# EAGLE design MAX232 (EAGLE 5.11)
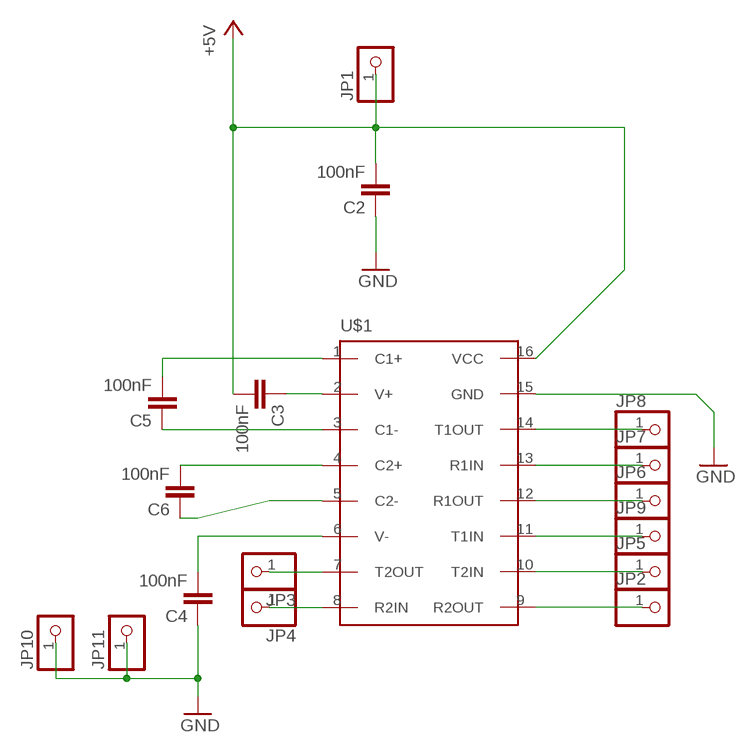
[diagram p0: schematic, sheet 1]

## Parts
C2  100nF  C-EUC1206  [C1206]
C3  100nF  C-EUC1206  [C1206]
C4  100nF  C-EUC1206  [C1206]
C5  100nF  C-EUC1206  [C1206]
C6  100nF  C-EUC1206  [C1206]
JP1  PINHD-1X1  [1X01]
JP2  PINHD-1X1  [1X01]
JP3  PINHD-1X1  [1X01]
JP4  PINHD-1X1  [1X01]
JP5  PINHD-1X1  [1X01]
JP6  PINHD-1X1  [1X01]
JP7  PINHD-1X1  [1X01]
JP8  PINHD-1X1  [1X01]
JP9  PINHD-1X1  [1X01]
JP10  PINHD-1X1  [1X01]
JP11  PINHD-1X1  [1X01]
U$1  MAX232ACUE  [TSSOP16]

## Nets
+5V: C2.2 C3.2 JP1.1 U$1.16(VCC)
GND: C2.1 C4.1 JP10.1 JP11.1 U$1.15(GND)
N$1: C5.2 U$1.1(C1+)
N$2: C5.1 U$1.3(C1-)
N$3: C6.1 U$1.5(C2-)
N$4: C6.2 U$1.4(C2+)
N$5: C4.2 U$1.6(V-)
N$6: C3.1 U$1.2(V+)
N$7: JP8.1 U$1.14(T1OUT)
N$8: JP7.1 U$1.13(R1IN)
N$9: JP6.1 U$1.12(R1OUT)
N$10: JP9.1 U$1.11(T1IN)
N$11: JP5.1 U$1.10(T2IN)
N$12: JP2.1 U$1.9(R2OUT)
N$13: JP4.1 U$1.8(R2IN)
N$14: JP3.1 U$1.7(T2OUT)

## Library data of the parts
C2-C6 = rcl:C-EU: CAPACITOR, European symbol
JP1-JP11 = pinhead:PINHD-1X1: PIN HEADER
U$1 = sams:MAX232ACUE

## Board
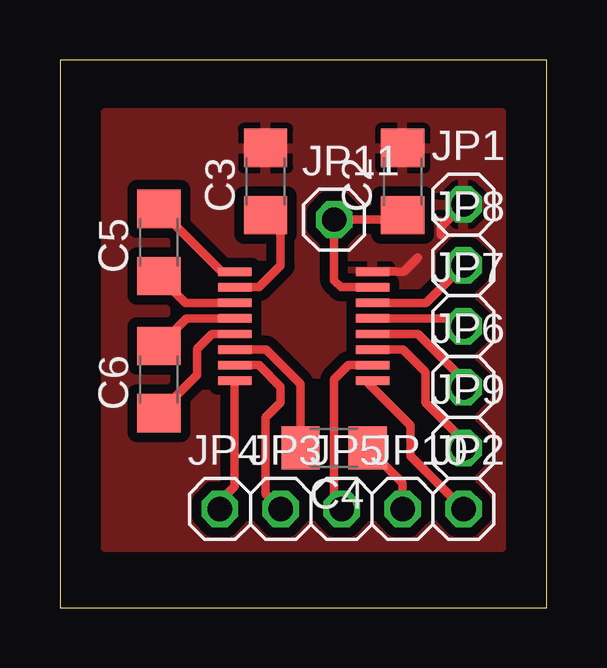
[diagram p1: board, top side]
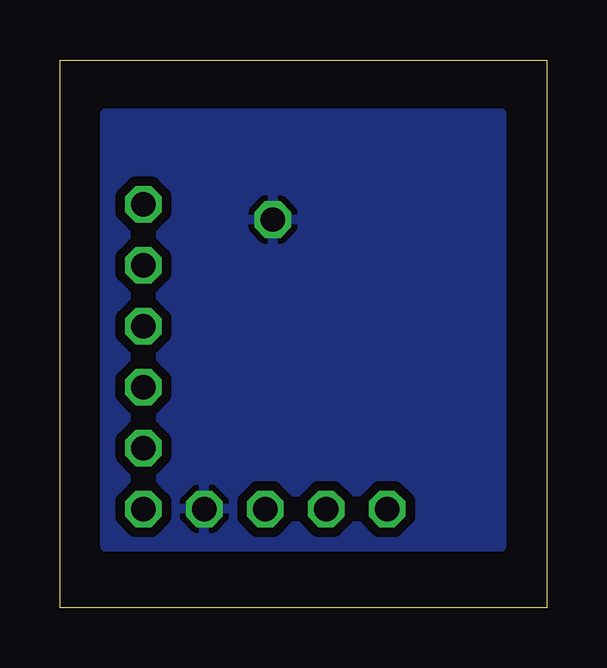
[diagram p2: board, bottom side, seen from below]

Size 20.31 x 22.85 mm. Coordinates in mm from the lower left corner, seen from the top.
Outline: 0,0 20.31,0 20.31,22.85 0,22.85 0,0
Copper layers (1*16): Top 0.035mm / dielectric 1.5mm / Bottom 0.035mm
Design rules "default": minimum track width 10mil, minimum drill 24mil, track to track 8mil, track to pad 8mil, pad to pad 8mil, via to via 8mil, smd to smd 8mil, copper to edge 40mil, drill to drill 8mil, minimum pad ring 10mil, minimum via ring 8mil, stop-mask expansion 4mil, vias tented up to drill 0mil, thermal gap 10mil

### Footprints (pad centres in the part's own frame; a part is rotated, then mirrored left to right if it is on the bottom)
C1206 = smd 1.6 x 1.8: 1 -1.4,0; 2 1.4,0
1X01 = drill 1.016 octagon: 1 0,0
TSSOP16 = smd 1.4 x 0.35: 1 -2.875,2.275; 2 -2.875,1.625; 3 -2.875,0.975; 4 -2.875,0.325; 5 -2.875,-0.325; 6 -2.875,-0.975; 7 -2.875,-1.625; 8 -2.875,-2.275; 9 2.875,-2.275; 10 2.875,-1.625; 11 2.875,-0.975; 12 2.875,-0.325; 13 2.875,0.325; 14 2.875,0.975; 15 2.875,1.625; 16 2.875,2.275

### Placement (x,y rotation side)
C2  14.29,17.78 90 top
C3  8.57,17.78 90 top
C4  11.43,6.67 180 top
C5  4.13,15.24 90 top
C6  4.13,9.53 90 top
JP1  16.83,16.83 0 top
JP2  16.83,4.13 0 top
JP3  9.21,4.13 0 top
JP4  6.67,4.13 0 top
JP5  11.75,4.13 0 top
JP6  16.83,9.21 0 top
JP7  16.83,11.75 0 top
JP8  16.83,14.29 0 top
JP9  16.83,6.67 0 top
JP10  14.29,4.13 0 top
JP11  11.43,16.19 0 top
U$1  10.16,11.75 0 top

### Tracks (layer width: path | path; a pad name or v marks a point on that pad's centre or on a via)
+5V
  Top 0.35: U$1.16 14.34,14.02 14.92,14.61 | JP1.1 15.88,15.88 15.88,15.56
  pour Top (isolate 0.406): 18.41,20.64 1.91,20.64 1.91,2.54 18.41,2.54
GND
  Top 0.35: U$1.15 11.71,13.37 11.43,13.65 JP11.1 14.1,16.19 C2.1 | JP10.1 14.29,5.21 C4.1
  pour Bottom (isolate 0.406): 18.41,20.64 1.91,20.64 1.91,2.54 18.41,2.54
N$1
  Top 0.35: U$1.1 6.75,14.02 C5.2
N$2
  Top 0.35: U$1.3 5.25,12.72 C5.1
N$3
  Top 0.35: C6.1 5.71,9.71 5.71,10.79 6.34,11.42 U$1.5
N$4
  Top 0.35: U$1.4 5.28,12.07 C6.2
N$5
  Top 0.35: U$1.6 8.6,10.77 10.03,9.34 C4.2
N$6
  Top 0.35: U$1.2 8.29,13.37 9.21,14.29 9.21,15.74 C3.1
N$7
  Top 0.35: U$1.14 15.26,12.72 JP8.1
N$8
  Top 0.35: JP7.1 16.83,12.07 U$1.13
N$9
  Top 0.35: U$1.12 14.93,11.42 16.51,9.84 JP6.1
N$10
  Top 0.35: U$1.11 14.31,10.77 15.24,9.84 15.24,8.57 16.83,6.99 JP9.1
N$11
  Top 0.35: U$1.10 12.03,10.12 11.43,9.53 11.43,4.45 JP5.1
N$12
  Top 0.35: JP2.1 14.61,6.35 14.61,7.62 12.86,9.37 12.93,9.37 U$1.9 13.07,9.47
N$13
  Top 0.35: U$1.8 7.29,5.06 6.67,4.45 JP4.1
N$14
  Top 0.35: U$1.7 8.29,10.12 9.21,9.21 9.21,8.57 8.57,7.94 8.57,4.76 JP3.1